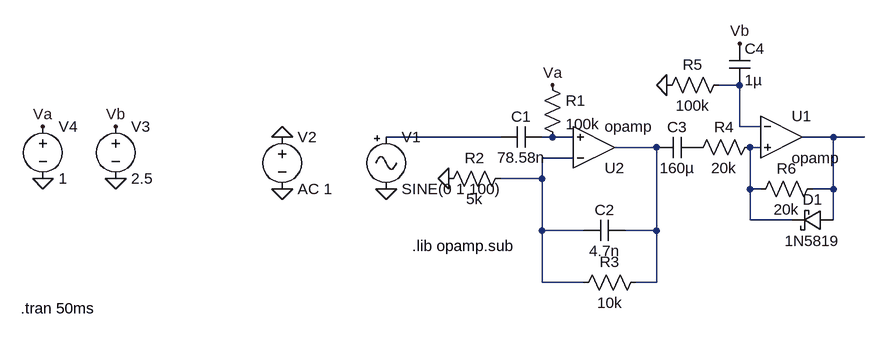
[diagram p0: schematic Draft1.asc]
Draft1.asc, the LTspice schematic file:
Version 4
SHEET 1 880 680
WIRE 368 16 336 16
WIRE 368 80 368 16
WIRE 400 80 368 80
WIRE 0 96 -176 96
WIRE 80 96 64 96
WIRE 112 96 80 96
WIRE 512 96 464 96
WIRE 560 96 512 96
WIRE 240 112 176 112
WIRE 400 112 384 112
WIRE 112 128 64 128
WIRE 64 160 64 128
WIRE 64 160 0 160
WIRE 384 176 384 112
WIRE 400 176 384 176
WIRE 512 176 512 96
WIRE 512 176 480 176
WIRE 384 224 384 176
WIRE 448 224 384 224
WIRE 512 224 512 176
WIRE 64 240 64 160
WIRE 128 240 64 240
WIRE 240 240 240 112
WIRE 240 240 192 240
WIRE 64 320 64 240
WIRE 128 320 64 320
WIRE 240 320 240 240
WIRE 240 320 208 320
FLAG -80 160 0
FLAG 256 16 0
FLAG -176 176 0
FLAG 80 16 Va
FLAG 368 -48 Vb
FLAG -704 80 Va
FLAG -592 80 Vb
FLAG -592 160 0
FLAG -704 160 0
FLAG -336 176 0
FLAG -336 96 0
SYMBOL cap 64 80 R90
WINDOW 0 0 32 VBottom 2
WINDOW 3 32 32 VTop 2
SYMATTR InstName C1
SYMATTR Value 78.58n
SYMBOL res 64 0 R0
SYMATTR InstName R1
SYMATTR Value 100k
SYMBOL res 16 144 R90
WINDOW 0 0 56 VBottom 2
WINDOW 3 32 56 VTop 2
SYMATTR InstName R2
SYMATTR Value 5k
SYMBOL cap 192 224 R90
WINDOW 0 0 32 VBottom 2
WINDOW 3 32 32 VTop 2
SYMATTR InstName C2
SYMATTR Value 4.7n
SYMBOL res 224 304 R90
WINDOW 0 0 56 VBottom 2
WINDOW 3 32 56 VTop 2
SYMATTR InstName R3
SYMATTR Value 10k
SYMBOL cap 304 96 R90
WINDOW 0 0 32 VBottom 2
WINDOW 3 32 32 VTop 2
SYMATTR InstName C3
SYMATTR Value 160µ
SYMBOL res 400 96 R90
WINDOW 0 0 56 VBottom 2
WINDOW 3 32 56 VTop 2
SYMATTR InstName R4
SYMATTR Value 20k
SYMBOL cap 352 -48 R0
SYMATTR InstName C4
SYMATTR Value 1µ
SYMBOL res 352 0 R90
WINDOW 0 0 56 VBottom 2
WINDOW 3 32 56 VTop 2
SYMATTR InstName R5
SYMATTR Value 100k
SYMBOL res 496 160 R90
WINDOW 0 0 56 VBottom 2
WINDOW 3 32 56 VTop 2
SYMATTR InstName R6
SYMATTR Value 20k
SYMBOL voltage -336 80 R0
SYMATTR InstName V2
SYMATTR Value AC 1
SYMBOL voltage -592 64 R0
SYMATTR InstName V3
SYMATTR Value 2.5
SYMBOL voltage -704 64 R0
SYMATTR InstName V4
SYMATTR Value 1
SYMBOL OpAmps\\opamp 432 32 R0
SYMATTR InstName U1
SYMBOL OpAmps\\opamp 144 176 M180
SYMATTR InstName U2
SYMBOL Misc\\signal -176 80 R0
WINDOW 123 0 0 Left 0
WINDOW 39 0 0 Left 0
SYMATTR InstName V1
SYMATTR Value SINE(0 1 100)
SYMBOL schottky 512 208 R90
WINDOW 0 0 32 VBottom 2
WINDOW 3 32 32 VTop 2
SYMATTR InstName D1
SYMATTR Value 1N5819
SYMATTR Description Diode
SYMATTR Type diode
TEXT -136 264 Left 2 !.lib opamp.sub
TEXT -738 360 Left 2 !.tran 50ms

The netlist it stands for:
* Draft1.asc
C1 N003 N002 78.58n
R1 Va N003 100k
R2 N007 0 5k
C2 N005 N007 4.7n
R3 N005 N007 10k
C3 P001 N005 160µ
R4 N006 P001 20k
C4 Vb N001 1µ
R5 N001 0 100k
R6 N004 N006 20k
V2 0 0 AC 1
V3 Vb 0 2.5
V4 Va 0 1
XU1 N001 N006 N004 opamp Aol=100K GBW=10Meg  ; pins invin noninvin out
XU2 N007 N003 N005 opamp Aol=100K GBW=10Meg  ; pins invin noninvin out
V1 N002 0 SINE(0 1 100)
D1 N004 N006 1N5819
.model D D
.lib standard.dio
.lib opamp.sub
.tran 50ms
.backanno
.end